# Altium schematic sheet CLK_SYNTH.SchDoc: My title
size A3; Organization: University of California; Address1: 475 Portola Plaza; Address2: Los Angeles, CA 90095; Revision: R01; SheetNumber: 1; SheetTotal: 1
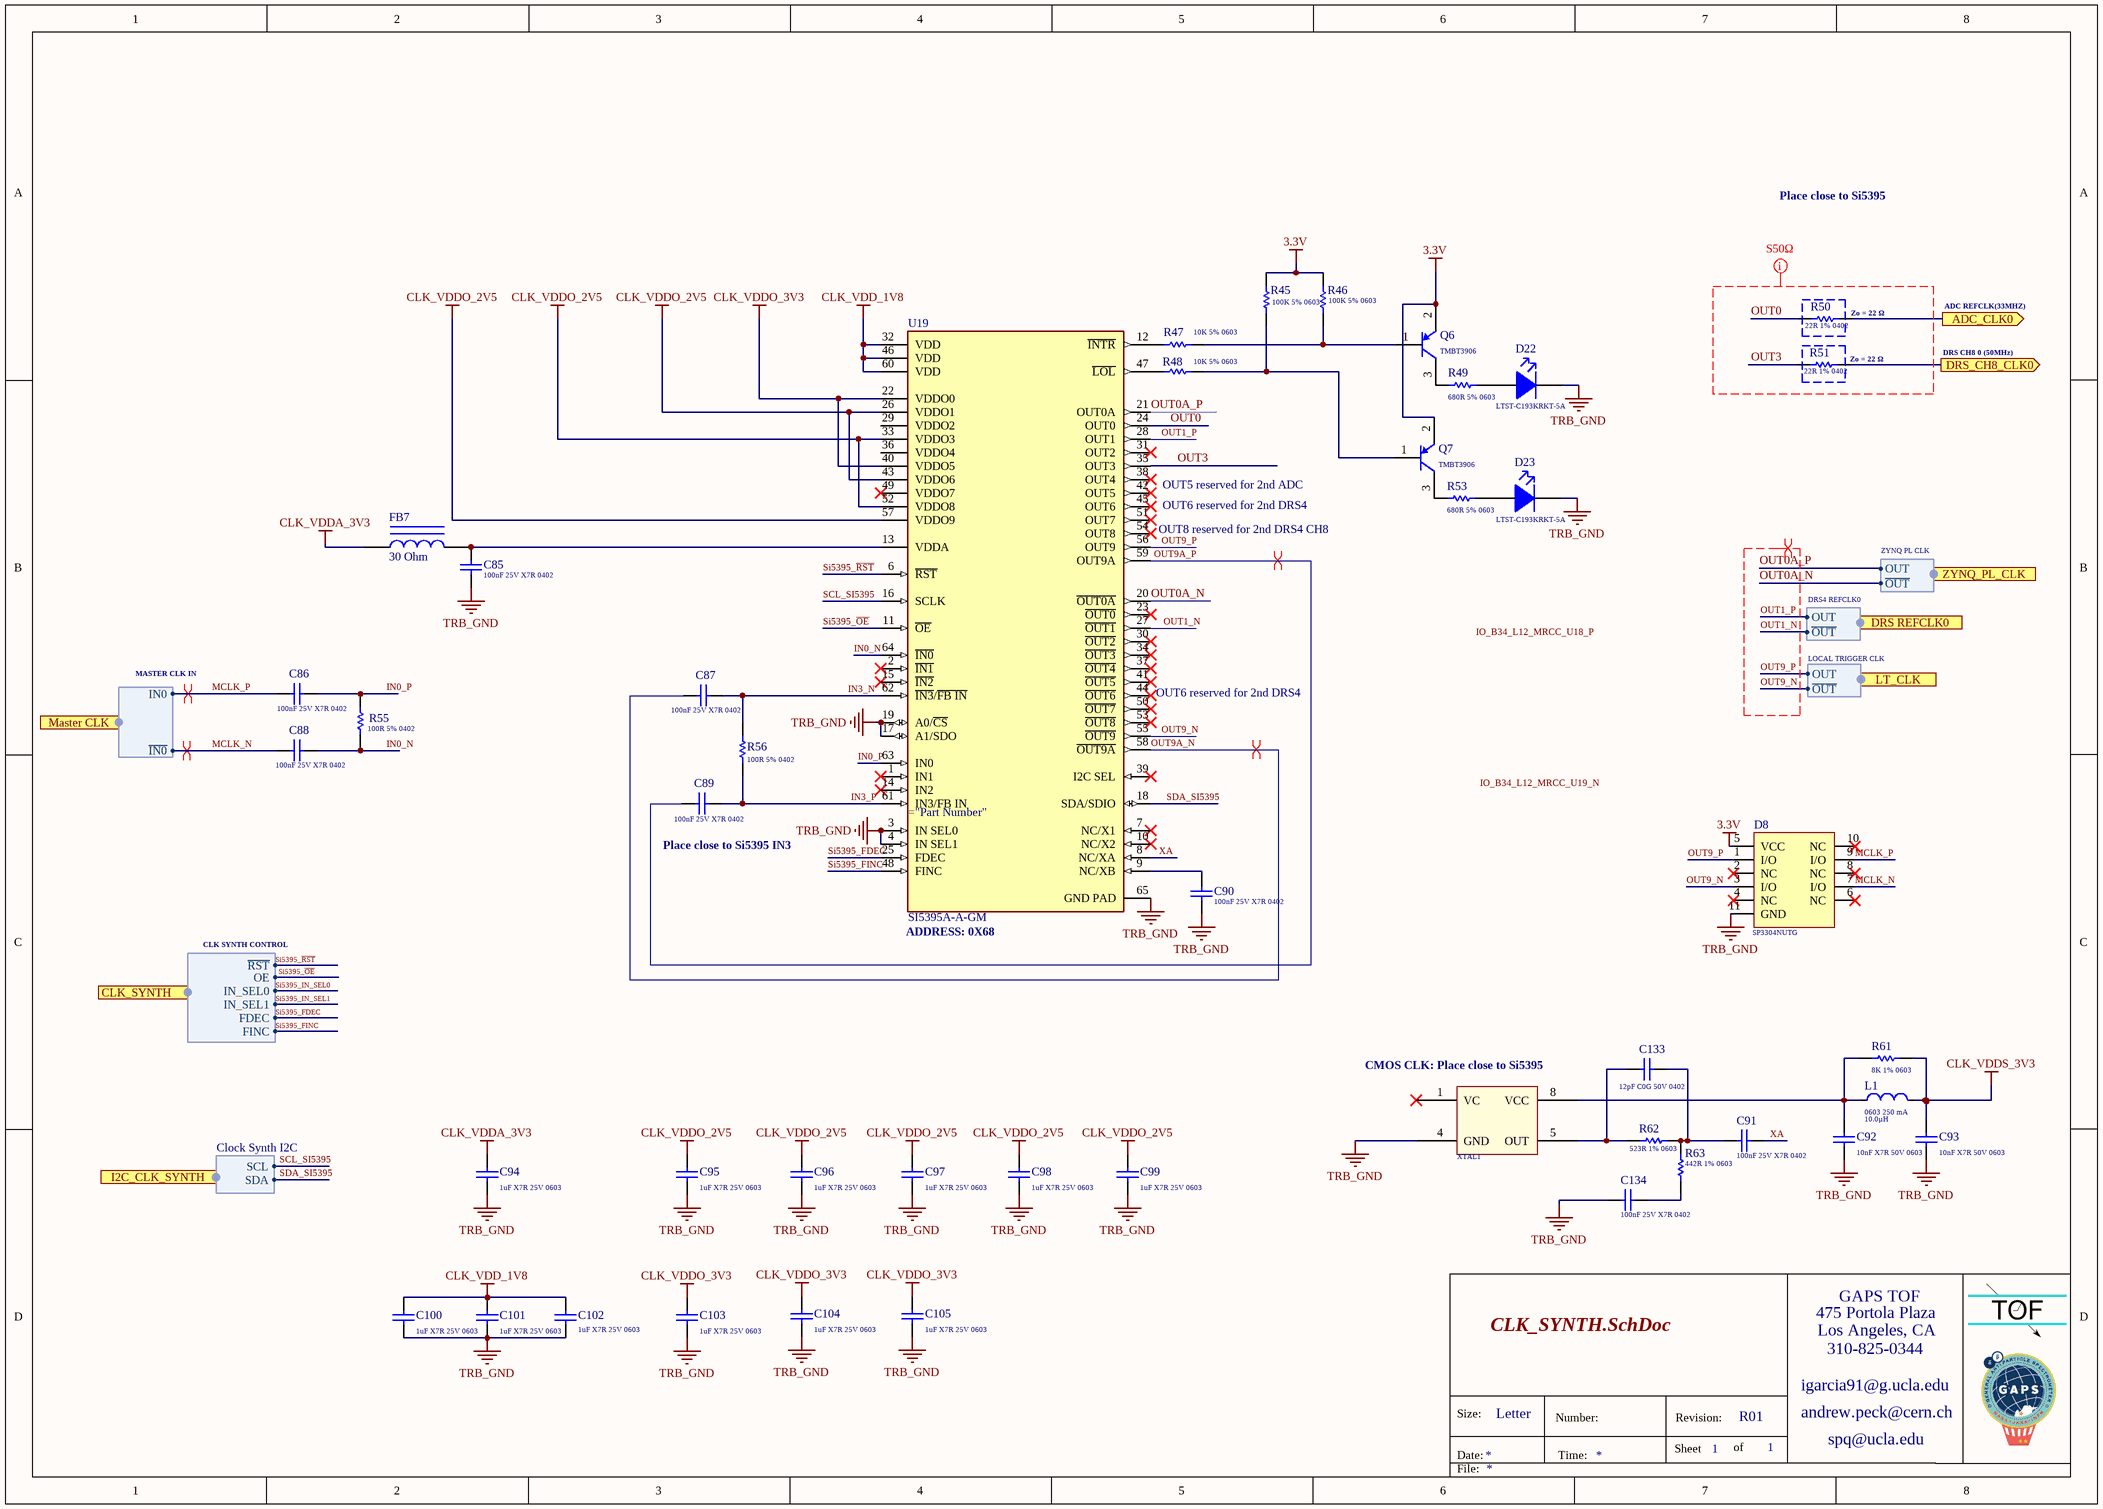
[diagram p0: CLK_SYNTH.SchDoc]

## Parts
C85  Capacitance: 100nF 25V X7R 0402  [Cap_Taiyo_Yuden_TMK105B7104KV-FR_100nF]  (hidden comment: Cap_Taiyo_Yuden_TMK105B7104KV-FR_100nF)
C86  Capacitance: 100nF 25V X7R 0402  [Cap_Taiyo_Yuden_TMK105B7104KV-FR_100nF]  (hidden comment: Cap_Taiyo_Yuden_TMK105B7104KV-FR_100nF)
C87  Capacitance: 100nF 25V X7R 0402  [Cap_Taiyo_Yuden_TMK105B7104KV-FR_100nF]  (hidden comment: Cap_Taiyo_Yuden_TMK105B7104KV-FR_100nF)
C88  Capacitance: 100nF 25V X7R 0402  [Cap_Taiyo_Yuden_TMK105B7104KV-FR_100nF]  (hidden comment: Cap_Taiyo_Yuden_TMK105B7104KV-FR_100nF)
C89  Capacitance: 100nF 25V X7R 0402  [Cap_Taiyo_Yuden_TMK105B7104KV-FR_100nF]  (hidden comment: Cap_Taiyo_Yuden_TMK105B7104KV-FR_100nF)
C90  Capacitance: 100nF 25V X7R 0402  [Cap_Taiyo_Yuden_TMK105B7104KV-FR_100nF]  (hidden comment: Cap_Taiyo_Yuden_TMK105B7104KV-FR_100nF)
C91  Capacitance: 100nF 25V X7R 0402  [Cap_Taiyo_Yuden_TMK105B7104KV-FR_100nF]  (hidden comment: Cap_Taiyo_Yuden_TMK105B7104KV-FR_100nF)
C92  Capacitance: 10nF X7R 50V 0603  [Kemet_C0603_0]  (hidden comment: Cap_Kemet_C0603C103J5RACTU_eec)
C93  Capacitance: 10nF X7R 50V 0603  [Kemet_C0603_0]  (hidden comment: Cap_Kemet_C0603C103J5RACTU_eec)
C94  Capacitance: 1uF X7R 25V 0603  [Cap_Murata_GCJ188R71E105KA01J_1uF]  (hidden comment: Cap_Murata_GCJ188R71E105KA01J_1uF)
C95  Capacitance: 1uF X7R 25V 0603  [Cap_Murata_GCJ188R71E105KA01J_1uF]  (hidden comment: Cap_Murata_GCJ188R71E105KA01J_1uF)
C96  Capacitance: 1uF X7R 25V 0603  [Cap_Murata_GCJ188R71E105KA01J_1uF]  (hidden comment: Cap_Murata_GCJ188R71E105KA01J_1uF)
C97  Capacitance: 1uF X7R 25V 0603  [Cap_Murata_GCJ188R71E105KA01J_1uF]  (hidden comment: Cap_Murata_GCJ188R71E105KA01J_1uF)
C98  Capacitance: 1uF X7R 25V 0603  [Cap_Murata_GCJ188R71E105KA01J_1uF]  (hidden comment: Cap_Murata_GCJ188R71E105KA01J_1uF)
C99  Capacitance: 1uF X7R 25V 0603  [Cap_Murata_GCJ188R71E105KA01J_1uF]  (hidden comment: Cap_Murata_GCJ188R71E105KA01J_1uF)
C100  Capacitance: 1uF X7R 25V 0603  [Cap_Murata_GCJ188R71E105KA01J_1uF]  (hidden comment: Cap_Murata_GCJ188R71E105KA01J_1uF)
C101  Capacitance: 1uF X7R 25V 0603  [Cap_Murata_GCJ188R71E105KA01J_1uF]  (hidden comment: Cap_Murata_GCJ188R71E105KA01J_1uF)
C102  Capacitance: 1uF X7R 25V 0603  [Cap_Murata_GCJ188R71E105KA01J_1uF]  (hidden comment: Cap_Murata_GCJ188R71E105KA01J_1uF)
C103  Capacitance: 1uF X7R 25V 0603  [Cap_Murata_GCJ188R71E105KA01J_1uF]  (hidden comment: Cap_Murata_GCJ188R71E105KA01J_1uF)
C104  Capacitance: 1uF X7R 25V 0603  [Cap_Murata_GCJ188R71E105KA01J_1uF]  (hidden comment: Cap_Murata_GCJ188R71E105KA01J_1uF)
C105  Capacitance: 1uF X7R 25V 0603  [Cap_Murata_GCJ188R71E105KA01J_1uF]  (hidden comment: Cap_Murata_GCJ188R71E105KA01J_1uF)
C133  Capacitance: 12pF C0G 50V 0402  [Cap_Murata_GCQ1555C1H120FB01D_12pF]  (hidden comment: Cap_Murata_GCQ1555C1H120FB01D_12pF)
C134  Capacitance: 100nF 25V X7R 0402  [Cap_Taiyo_Yuden_TMK105B7104KV-FR_100nF]  (hidden comment: Cap_Taiyo_Yuden_TMK105B7104KV-FR_100nF)
D8  Series: SP3304NUTG  [ESD_LittleFuse_SP3304NUTG_3V3]  (hidden comment: ESD_LittleFuse_SP3304NUTG_3V3)
D22  LTST-C193KRKT-5A  [Led_Lite-On_LTST-C193KGKT-5A_Red]
D23  LTST-C193KRKT-5A  [Led_Lite-On_LTST-C193KGKT-5A_Red]
FB7  30 Ohm  [Feb_MURATA_BLM15AX300SZ1D_30]
L1  0603 250 mA  Inductance: 10.0µH  [TDK_MLZ1608M100WT_0]
Q6  Series: TMBT3906  [BJT_PNP_Toshiba_TMBT3906]  (hidden comment: BJT_PNP_Toshiba_TMBT3906)
Q7  Series: TMBT3906  [BJT_PNP_Toshiba_TMBT3906]  (hidden comment: BJT_PNP_Toshiba_TMBT3906)
R45  100K 5% 0603  [RESC0603(1608)_N]
R46  100K 5% 0603  [RESC0603(1608)_N]
R47  10K 5% 0603  [RESC0603(1608)_L]
R48  10K 5% 0603  [RESC0603(1608)_L]
R49  680R 5% 0603  [RESC0603(1608)_L]
R50  22R 1% 0402  [RESC0402(1005)_L]
R51  22R 1% 0402  [RESC0402(1005)_L]
R53  680R 5% 0603  [RESC0603(1608)_L]
R55  100R 5% 0402  [RESC0402(1005)_L]
R56  100R 5% 0402  [RESC0402(1005)_L]
R61  8K 1% 0603  [Res_Yageo_RT0603BRE078KL_8K]
R62  Resistance: 523R 1% 0603  [Res_Vishay_CRCW0603523RFKEA_523Ohm]  (hidden comment: Res_Vishay_CRCW0603523RFKEA_523Ohm)
R63  Resistance: 442R 1% 0603  [Res_Bourns_CR0603-FX-4420ELF_442Ohm]  (hidden comment: Res_Bourns_CR0603-FX-4420ELF_442Ohm)
U19  Series: SI5395A-A-GM  [Si5395]  (hidden comment: IC_Silicon_Laboratories_ SI5395A-A-GM_CLK)
XTAL1  TCXO_Murata_XTCLH50M000CHJA3P0_50MHz  [TCXO_Murata_XTCLH50M000CHJA3P0_50MHz]  (value not drawn)

## Ports
ADC_CLK0 (out), CLK_SYNTH (harness CLK SYNTH CONTROL), DRS REFCLK0 (harness DRS4 REFCLK0), DRS_CH8_CLK0 (out), I2C_CLK_SYNTH (harness Clock Synth I2C), LT_CLK (harness LOCAL TRIGGER CLK), Master CLK (harness MASTER CLK IN), ZYNQ_PL_CLK (harness ZYNQ PL CLK)

## Harnesses
MASTER CLK IN: IN0, ~{IN0}
CLK SYNTH CONTROL: ~{RST}, OE, IN_SEL0, IN_SEL1, FDEC, FINC
DRS4 REFCLK0: OUT, ~{OUT}
ZYNQ PL CLK: OUT, ~{OUT}
LOCAL TRIGGER CLK: OUT, ~{OUT}
Clock Synth I2C: SCL, SDA

## Nets
3.3V: D8.5(VCC) Q6.2(E) Q7.2(E) R45.2 R46.2
CLK_VDD_1V8: C100.2 C101.2 C102.2 U19.32(VDD) U19.46(VDD) U19.60(VDD)
CLK_VDDA_3V3: C94.2 FB7.1
CLK_VDDO_2V5: C95.2 C96.2 C97.2 C98.2 C99.2 U19.26(VDDO1) U19.33(VDDO3) U19.43(VDDO6) U19.52(VDDO8) U19.57(VDDO9)
CLK_VDDO_3V3: C103.2 C104.2 C105.2 U19.22(VDDO0) U19.40(VDDO5)
CLK_VDDS_3V3: C93.1 L1.2 R61.2
TRB_GND: C85.1 C90.1 C92.2 C93.2 C94.1 C95.1 C96.1 C97.1 C98.1 C99.1 C100.1 C101.1 C102.1 C103.1 C104.1 C105.1 C134.1 D8.11(GND) D22.1(K) D23.1(K) U19.3(IN_SEL0) U19.4(IN_SEL1) U19.17(A1/SDO) U19.19(A0/~{CS}) U19.65(GND_PAD) XTAL1.4(GND)
ADC_CLK0: R50.1 ; port ADC_CLK0
DRS_CH8_CLK0: R51.1 ; port DRS_CH8_CLK0
IN0_N: C88.2 R55.1 U19.64(~{IN0})
IN0_P: C86.2 R55.2 U19.63(IN0)
IN3_N: C87.2 R56.2 U19.62(~{IN3}/~{FB_IN})
IN3_P: C89.2 R56.1 U19.61(IN3/FB_IN)
MCLK_N: C88.1 D8.7(I/O) ; port Master CLK.~{IN0}
MCLK_P: C86.1 D8.9(I/O) ; port Master CLK.IN0
OUT0: R50.2 U19.24(OUT0)
OUT0A_N: U19.20(~{OUT0A}) ; port ZYNQ_PL_CLK.~{OUT}
OUT0A_P: U19.21(OUT0A) ; port ZYNQ_PL_CLK.OUT
OUT1_N: U19.27(~{OUT1}) ; port DRS REFCLK0.~{OUT}
OUT1_P: U19.28(OUT1) ; port DRS REFCLK0.OUT
OUT3: R51.2 U19.35(OUT3)
OUT9_N: D8.3(I/O) U19.55(~{OUT9}) ; port LT_CLK.~{OUT}
OUT9_P: D8.1(I/O) U19.56(OUT9) ; port LT_CLK.OUT
OUT9A_N: C87.1 U19.58(~{OUT9A})
OUT9A_P: C89.1 U19.59(OUT9A)
SCL_SI5395: U19.16(SCLK) ; port I2C_CLK_SYNTH.SCL
SDA_SI5395: U19.18(SDA/SDIO) ; port I2C_CLK_SYNTH.SDA
Si5395_FDEC: U19.25(FDEC) ; port CLK_SYNTH.FDEC
Si5395_FINC: U19.48(FINC) ; port CLK_SYNTH.FINC
Si5395_IN_SEL0: port CLK_SYNTH.IN_SEL0
Si5395_IN_SEL1: port CLK_SYNTH.IN_SEL1
Si5395_~{OE}: U19.11(~{OE}) ; port CLK_SYNTH.OE
Si5395_~{RST}: U19.6(~{RST}) ; port CLK_SYNTH.~{RST}
XA: C91.2 U19.8(NC/XA)
NetC85_2: C85.2 FB7.2 U19.13(VDDA)
NetC90_2: C90.2 U19.9(NC/XB)
NetC91_1: C91.1 C133.1 R62.2 R63.2
NetC92_1: C92.1 L1.1 R61.1 XTAL1.8(VCC)
NetC133_2: C133.2 R62.1 XTAL1.5(OUT)
NetC134_2: C134.2 R63.1
NetD22_2: D22.2(A) R49.2
NetD23_2: D23.2(A) R53.2
NetQ6_1: Q6.1(B) R46.1 R47.1
NetQ6_3: Q6.3(C) R49.1
NetQ7_1: Q7.1(B) R45.1 R48.1
NetQ7_3: Q7.3(C) R53.1
NetR47_2: R47.2 U19.12(~{INTR})
NetR48_2: R48.2 U19.47(~{LOL})

Not connected (* = marked no-connect by the designer): D8 2(NC)* 4(NC)* 6(NC)* 8(NC)* 10(NC)*; U19 1(IN1)* 2(~{IN1})* 7(NC/X1)* 10(NC/X2)* 14(IN2)* 15(~{IN2})* 23(~{OUT0})* 29(VDDO2) 30(~{OUT2})* 31(OUT2)* 34(~{OUT3})* 36(VDDO4) 37(~{OUT4})* 38(OUT4)* 39(I2C_SEL)* 41(~{OUT5})* 42(OUT5)* 44(~{OUT6})* 45(OUT6)* 49(VDDO7)* 50(~{OUT7})* 51(OUT7)* 53(~{OUT8})* 54(OUT8)*; XTAL1 1(VC)*

## Layout directives
differential pair: MCLK_N, MCLK_P, OUT0A_N, OUT0A_P, OUT1_N, OUT1_P, OUT9_N, OUT9_P, OUT9A_N, OUT9A_P
net class S50: OUT0, OUT3

## Notes on the sheet
- Place close to Si5395
- (near R50) Zo = 22 Ω
- ADC REFCLK(33MHZ)
- (near R51) Zo = 22 Ω
- DRS CH8 0 (50MHz)
- (near U19) OUT5 reserved for 2nd ADC
- (near U19) OUT6 reserved for 2nd DRS4
- (near U19) OUT8 reserved for 2nd DRS4 CH8
- (near C89) Place close to Si5395 IN3
- (near U19) ADDRESS: 0X68
- (near XTAL1) CMOS CLK: Place close to Si5395
- Labels drawn without touching a wire or pin: IO_B34_L12_MRCC_U18_P, IO_B34_L12_MRCC_U19_N
- 475 Portola Plaza
- GAPS TOF
- igarcia91@g.ucla.edu
- Los Angeles, CA
- 310-825-0344
- Size:
- Date:
- Letter
- Number:
- Time:
- Sheet
- Revision:
- of
- andrew.peck@cern.ch
- spq@ucla.edu
- File:

## Library data of the parts
C85-C91 C134 = Cap_Taiyo_Yuden_TMK105B7104KV-FR_100nF: CAP CER 100nF 25V X7R 0402; Supplier 1: Mouser; Supplier Part Number 1: 963-TMK105B7104KV-FR
C92 C93 = Cap_Kemet_C0603C103J5RACTU_eec: CAP CER 10nF 50V X7R 0603; Manufacturer: Kemet; Mfg Package Ident: C0603; Part Number: C0603C103J5RACTU; helpURL: https://upverter.com/upn/revision/8a8d0c297e33ac74/; ComponentLink2Description: Datasheet; Temperature: -55°C to +125°C; Package: C0603; Supplier 2: Mouser; Price: 0.0184203126773; Supplier 1: Digi-Key; ComponentLink1URL: https://upverter.com/upn/revision/8a8d0c297e33ac74/; Supplier Part Number 2: 80-C0603C103J5R; Supplier Part Number 1: 399-1092-1-ND; Value: 10nF; ComponentLink1Description: Upverter; ComponentLink2URL: https://content.kemet.com/datasheets/KEM_C1002_X7R_SMD.pdf; RoHS: TRUE; Mouser Part Number: 80-C0603C103J5R; Temperature Range High: +125°C; Digikey Description: CAP CER 10000PF 50V X7R 0603; Digikey Part Number: 399-1092-1-ND; Lead Free: yes; Temperature Range Low: -55°C; Voltage: 50V
C94-C105 = Cap_Murata_GCJ188R71E105KA01J_1uF: CAP CER 1uF 25V X7R 0603; Supplier 1: Mouser; Supplier Part Number 1: 81-GCJ188R71E105KA1J
C133 = Cap_Murata_GCQ1555C1H120FB01D_12pF: Multilayer Ceramic Capacitors MLCC - SMD/SMT 0402 50VDC 12pF 1% AEC-Q200; Supplier 1: Mouser; Supplier Part Number 1: 81-GCQ1555C1H120FB1D  81-GCQ1555C1H120FB1D
D8 = ESD_LittleFuse_SP3304NUTG_3V3: ESD Suppressors / TVS Diodes 4CH 20A 3.3V 3.5pF Lightning Protection; Supplier Part Number 1: 576-SP3304NUTG; Supplier 1: Mouser
D22 D23 = Led_Lite-On_LTST-C193KGKT-5A_Red: Standard LEDs - SMD Red 470nm 28mcd 20mA; Supplier 1: Mouser; Supplier Part Number 1: 859-LTSTC193KRKT5A; Series: LTST-C193KRKT-5A
FB7 = Feb_MURATA_BLM15AX300SZ1D_30: Feb SMD 30 OHM 25% 3/4W 0402; Supplier 1: Mouser; Supplier Part Number 1: 81-BLM15AX300SZ1D
L1 = Ind_TDK_MLZ1608M100WT_eec: IND 10µH Shielded Multilayer Inductor 250mA 1.365 Ohm Max 0603 (1608 Metric); Manufacturer: TDK; Value: 10.0µH; Tolerance: ±20%; Part Number: MLZ1608M100WT; helpURL: https://upverter.com/upn/revision/22fa022ced0eb0ec/; ComponentLink2Description: Datasheet; Temperature: -55°C to +125°C; Package: 0603 (1608 metric); Supplier 2: Mouser; Supplier 1: Digi-Key; ComponentLink1URL: https://upverter.com/upn/revision/22fa022ced0eb0ec/; Supplier Part Number 2: 810-MLZ1608M100WT000; Supplier Part Number 1: 445-6389-1-ND; ComponentLink1Description: Upverter; ComponentLink2URL: https://product.tdk.com/info/en/catalog/datasheets/inductor_commercial_decoupling_mlz1608_en.pdf; RoHS: TRUE; Mouser Part Number: 810-MLZ1608M100WT000; Current Rating: 250mA; Ipc Land Pattern Name: CAPC16080X45; Temperature Range High: +125°C; Digikey Description: IND 10µH Shielded Multilayer Inductor 250mA 1.365 Ohm Max 0603 (1608 Metric); Digikey Part Number: 445-6389-1-ND; Lead Free: yes; Temperature Range Low: -55°C; DC Resistance (DCR): 1.365 Ohm Max
Q6 Q7 = BJT_PNP_Toshiba_TMBT3906: Bipolar Transistors - BJT Transistor for Low Freq. Amplification; Supplier Part Number 1: TMBT3906,LM; Supplier 1: Mouser
R45 R46 = CMP-1012-00122-1: 100K 0.1W 5% 0603 (1608 Metric)  SMD; Case-EIA: 0603; Value: 100000.00 Ohm; Case-Metric: 1608; Tolerance: 5 %; Power: 0.1 W; Technology: SMT
R47 R48 = CMP-1012-00098-1: 10K 0.1W 5% 0603 (1608 Metric)  SMD; Case-EIA: 0603; Value: 10000.00 Ohm; Case-Metric: 1608; Technology: SMT; Tolerance: 5 %; Power: 0.1 W
R49 R53 = CMP-1012-00070-1: 680R 0.1W 5% 0603 (1608 Metric)  SMD; Case-EIA: 0603; Value: 680.00 Ohm; Case-Metric: 1608; Tolerance: 5 %; Technology: SMT; Power: 0.1 W
R50 R51 = CMP-1011-00320-1: 22R 0.063W 1% 0402 (1005 Metric)  SMD; Case-EIA: 0402; Case-Metric: 1005; Value: 22.00 Ohm; Tolerance: 1 %; Technology: SMT; Power: 0.063 W
R55 R56 = CMP-1011-00050-1: 100R 0.063W 5% 0402 (1005 Metric)  SMD; Case-EIA: 0402; Value: 100.00 Ohm; Case-Metric: 1005; Tolerance: 5 %; Technology: SMT; Power: 0.063 W
R61 = Res_Yageo_RT0603BRE078KL_8K: 8K 0.1W 1% 0603 (1608 Metric)  SMD; Supplier 1: Mouser; Supplier Part Number 1: 603-RT0603BRE078KL
R62 = Res_Vishay_CRCW0603523RFKEA_523Ohm: RES SMD 523 OHM 1% 1/10W 0603; Supplier 1: Mouser; Supplier Part Number 1: 71-CRCW0603-523-E3
R63 = Res_Bourns_CR0603-FX-4420ELF_442Ohm: RES SMD 442 OHM 1% 1/10W 0603; Supplier Part Number 1: 652-CR0603FX-4420ELF; Supplier 1: Mouser
U19 = IC_Silicon_Laboratories_ SI5395A-A-GM_CLK: Clock Synthesizer / Jitter Cleaner Single PLL jitter attenuator with xtal: 12-outputs up to 1028 MHz; integer+fractional; Supplier 1: Mouser; Supplier Part Number 1: 634-SI5395A-A-GM
XTAL1 = TCXO_Murata_XTCLH50M000CHJA3P0_50MHz: TCXO Oscillators 50MHz 5x3.2x1.5mm 0.2ppm max Crystal; Supplier 1: Mouser; Supplier Part Number 1: 81-XTCLH50M000CHJA3P; Supplier 2: Digi-Key; Supplier Part Number 2: 490-18042-1-ND